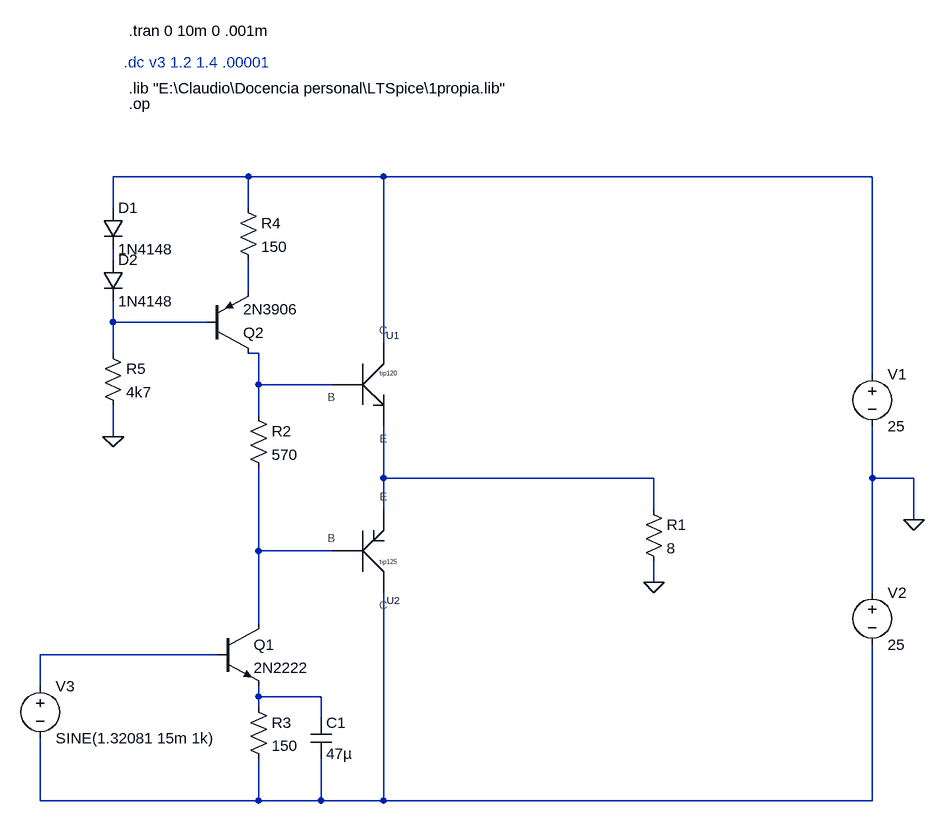
[diagram p0: schematic p3 parcial 2023.asc]
p3 parcial 2023.asc, the LTspice schematic file:
Version 4
SHEET 1 1572 856
WIRE 528 -112 320 -112
WIRE 736 -112 528 -112
WIRE 1488 -112 736 -112
WIRE 320 -64 320 -112
WIRE 528 -64 528 -112
WIRE 320 16 320 0
WIRE 528 64 528 16
WIRE 320 112 320 80
WIRE 464 112 320 112
WIRE 736 144 736 -112
WIRE 320 160 320 112
WIRE 544 160 528 160
WIRE 1488 192 1488 -112
WIRE 544 208 544 160
WIRE 656 208 544 208
WIRE 544 256 544 208
WIRE 320 288 320 240
WIRE 736 352 736 272
WIRE 1152 352 736 352
WIRE 1488 352 1488 272
WIRE 1552 352 1488 352
WIRE 736 400 736 352
WIRE 1152 400 1152 352
WIRE 1552 416 1552 352
WIRE 544 464 544 336
WIRE 656 464 544 464
WIRE 1152 512 1152 480
WIRE 1488 528 1488 352
WIRE 544 576 544 464
WIRE 480 624 208 624
WIRE 208 672 208 624
WIRE 544 688 544 672
WIRE 640 688 544 688
WIRE 544 704 544 688
WIRE 640 720 640 688
WIRE 208 848 208 752
WIRE 544 848 544 784
WIRE 544 848 208 848
WIRE 640 848 640 784
WIRE 640 848 544 848
WIRE 736 848 736 528
WIRE 736 848 640 848
WIRE 1488 848 1488 608
WIRE 1488 848 736 848
FLAG 1152 512 0
FLAG 1552 416 0
FLAG 320 288 0
DATAFLAG 944 352 ""
DATAFLAG 608 208 ""
DATAFLAG 608 464 ""
SYMBOL Propia\\Darlington\ npn 704 208 R0
SYMATTR Value tip120
SYMATTR InstName U1
SYMBOL Propia\\Darlington\ pnp 704 464 M180
SYMATTR Value tip125
SYMATTR InstName U2
SYMBOL res 1136 384 R0
SYMATTR InstName R1
SYMATTR Value 8
SYMBOL npn 480 576 R0
SYMATTR InstName Q1
SYMATTR Value 2N2222
SYMBOL voltage 1488 176 R0
WINDOW 123 0 0 Left 0
WINDOW 39 0 0 Left 0
SYMATTR InstName V1
SYMATTR Value 25
SYMBOL voltage 1488 512 R0
WINDOW 123 0 0 Left 0
WINDOW 39 0 0 Left 0
SYMATTR InstName V2
SYMATTR Value 25
SYMBOL res 528 240 R0
SYMATTR InstName R2
SYMATTR Value 570
SYMBOL res 528 688 R0
SYMATTR InstName R3
SYMATTR Value 150
SYMBOL cap 624 720 R0
SYMATTR InstName C1
SYMATTR Value 47µ
SYMBOL pnp 464 160 M180
SYMATTR InstName Q2
SYMATTR Value 2N3906
SYMBOL res 512 -80 R0
SYMATTR InstName R4
SYMATTR Value 150
SYMBOL diode 304 -64 R0
SYMATTR InstName D1
SYMATTR Value 1N4148
SYMBOL diode 304 16 R0
SYMATTR InstName D2
SYMATTR Value 1N4148
SYMBOL res 304 144 R0
SYMATTR InstName R5
SYMATTR Value 4k7
SYMBOL voltage 208 656 R0
WINDOW 123 0 0 Left 0
WINDOW 39 0 0 Left 0
SYMATTR InstName V3
SYMATTR Value SINE(1.32081 15m 1k)
TEXT 344 -248 Left 2 !.lib "E:\\Claudio\\Docencia personal\\LTSpice\\1propia.lib"
TEXT 344 -224 Left 2 !.op
TEXT 336 -288 Left 2 ;.dc v3 1.2 1.4 .00001
TEXT 344 -336 Left 2 !.tran 0 10m 0 .001m

The netlist it stands for:
* p3 parcial 2023.asc
XU1 N001 N005 N006 tip120  ; pins C B E
XU2 N010 N007 N006 tip125  ; pins C B E
R1 N006 0 8
Q1 N007 N008 N009 0 2N2222
V1 N001 0 25
V2 0 N010 25
R2 N005 N007 570
R3 N009 N010 150
C1 N009 N010 47µ
Q2 N005 N004 N003 0 2N3906
R4 N001 N003 150
D1 N001 N002 1N4148
D2 N002 N004 1N4148
R5 N004 0 4k7
V3 N008 N010 SINE(1.32081 15m 1k)
.model D D
.lib standard.dio
.model NPN NPN
.model PNP PNP
.lib standard.bjt
.lib "E:\Claudio\Docencia personal\LTSpice\1propia.lib"
.op
* .dc v3 1.2 1.4 .00001
.tran 0 10m 0 .001m
.backanno
.end